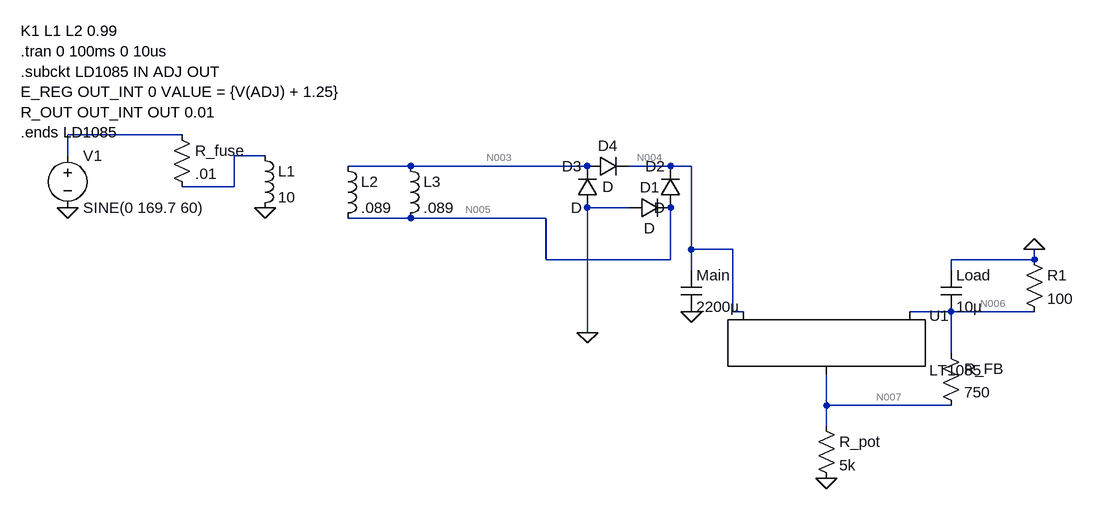
[diagram p0: schematic Draft2.asc]
Draft2.asc, the LTspice schematic file:
Version 4.1
SHEET 1 1572 1648
WIRE 192 592 16 592
WIRE 16 624 16 592
WIRE 320 624 272 624
WIRE 544 640 448 640
WIRE 816 640 544 640
WIRE 944 640 880 640
WIRE 976 640 944 640
WIRE 272 672 272 624
WIRE 272 672 192 672
WIRE 880 704 816 704
WIRE 544 720 448 720
WIRE 752 720 544 720
WIRE 976 768 976 640
WIRE 1040 768 976 768
WIRE 752 784 752 720
WIRE 944 784 944 704
WIRE 944 784 752 784
WIRE 1504 784 1504 768
WIRE 1504 784 1376 784
WIRE 976 800 976 768
WIRE 1376 800 1376 784
WIRE 1040 864 1040 768
WIRE 1056 864 1040 864
WIRE 1376 864 1312 864
WIRE 1504 864 1376 864
WIRE 816 896 816 704
WIRE 816 896 800 896
WIRE 1376 928 1376 864
WIRE 1184 1008 1184 960
WIRE 1376 1008 1184 1008
WIRE 1184 1040 1184 1008
FLAG 16 704 0
FLAG 1184 1120 0
FLAG 1504 768 0
FLAG 816 896 0
FLAG 320 704 0
FLAG 976 864 0
SYMBOL voltage 16 608 R0
WINDOW 123 0 0 Left 0
WINDOW 39 0 0 Left 0
SYMATTR InstName V1
SYMATTR Value SINE(0 169.7 60)
SYMBOL ind 304 608 R0
SYMATTR InstName L1
SYMATTR Value 10
SYMATTR Type ind
SYMBOL ind 432 624 R0
SYMATTR InstName L2
SYMATTR Value .089
SYMATTR Type ind
SYMBOL ind 528 624 R0
SYMATTR InstName L3
SYMATTR Value .089
SYMBOL diode 880 720 R270
WINDOW 0 32 32 VTop 2
WINDOW 3 0 32 VBottom 2
SYMATTR InstName D1
SYMBOL diode 832 704 R180
WINDOW 0 24 64 Left 2
WINDOW 3 24 0 Left 2
SYMATTR InstName D3
SYMBOL diode 960 704 R180
WINDOW 0 24 64 Left 2
WINDOW 3 24 0 Left 2
SYMATTR InstName D2
SYMBOL diode 816 656 R270
WINDOW 0 32 32 VTop 2
WINDOW 3 0 32 VBottom 2
SYMATTR InstName D4
SYMBOL cap 960 800 R0
SYMATTR InstName Main
SYMATTR Value 2200µ
SYMBOL res 176 576 R0
SYMATTR InstName R_fuse
SYMATTR Value .01
SYMBOL res 1360 912 R0
SYMATTR InstName R_FB
SYMATTR Value 750
SYMBOL res 1168 1024 R0
SYMATTR InstName R_pot
SYMATTR Value 5k
SYMBOL cap 1360 800 R0
SYMATTR InstName Load
SYMATTR Value 10µ
SYMBOL PowerProducts\\LT1085 1184 864 R0
SYMATTR InstName U1
SYMBOL res 1488 768 R0
SYMATTR InstName R1
SYMATTR Value 100
TEXT -56 432 Left 2 !K1 L1 L2 0.99\n.tran 0 100ms 0 10us\n.subckt LD1085 IN ADJ OUT\nE_REG OUT_INT 0 VALUE = {V(ADJ) + 1.25}\nR_OUT OUT_INT OUT 0.01\n.ends LD1085

The netlist it stands for:
* Draft2.asc
V1 N001 0 SINE(0 169.7 60)
L1 N002 0 10
L2 N003 N005 .089
L3 N003 N005 .089
D1 0 N005 D
D3 0 N003 D
D2 N005 N004 D
D4 N003 N004 D
C§Main N004 0 2200µ
R_fuse N001 N002 .01
R_FB N006 N007 750
R_pot N007 0 5k
C§Load 0 N006 10µ
X§U1 N007 N006 N004 LT1085
R1 0 N006 100
.model D D
.lib standard.dio
K1 L1 L2 0.99
.tran 0 100ms 0 10us
.subckt LD1085 IN ADJ OUT
E_REG OUT_INT 0 VALUE = {V(ADJ) + 1.25}
R_OUT OUT_INT OUT 0.01
.ends LD1085
.backanno
.end

* Results of the author's LTspice run, read from the files saved beside the schematic
* Operating Point, zero values left out:
*   V(n005) = -1.958 mV
*   V(n004) = -3.928 mV
*   V(n007) = -2.512 µV
*   V(n003) = -1.958 mV
*   V(n006) = 50.23 nV
*   I(R_FB) = 3.416 nA
*   I(R1) = -502.3 pA
*   I(R_pot) = -502.3 pA
*   Ix(u1:1) = 3.918 nA
*   Ix(u1:2) = -3.918 nA